# Altium schematic sheet 1 power.SchDoc
size A4; DocumentNumber: 1; SheetNumber: 3; SheetTotal: 9
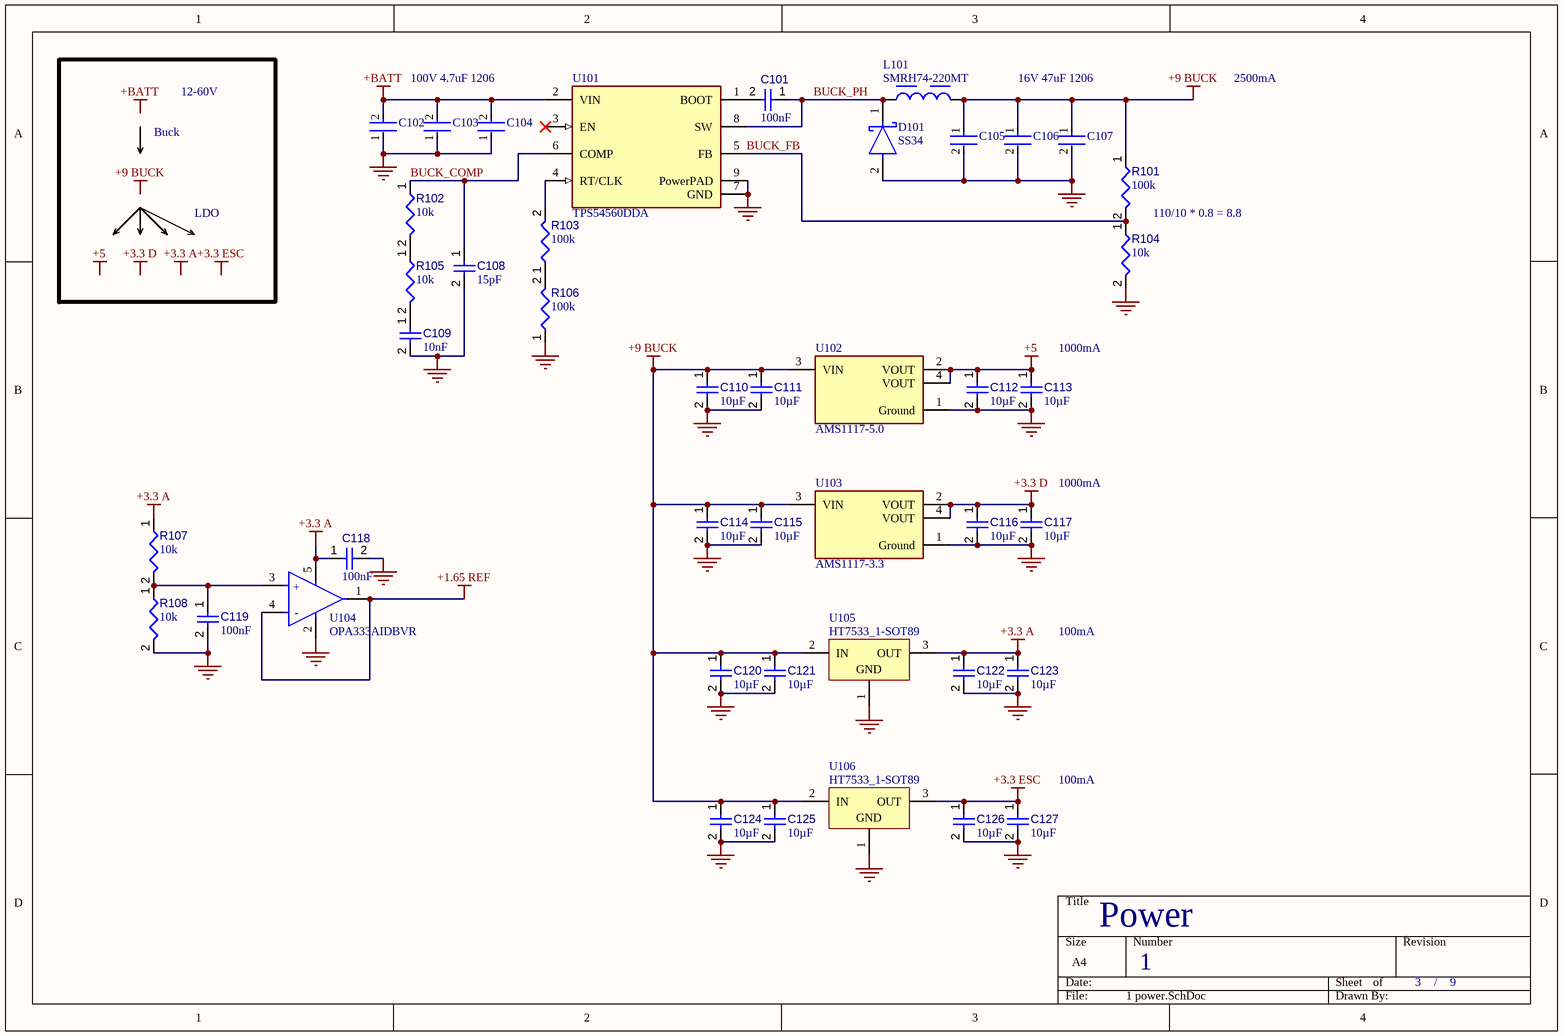
[diagram p0: 1 power.SchDoc]

## Parts
C101  value 100nF  [CAPC0402(1005)60_L]  (hidden comment: Capacitor 100nF +/-20% 25V 0402)
C102  GRM31CZ72A475KE11L  [FP-GRM31C-0_3-e0_3_0_9-MFG]  (value not drawn)
C103  GRM31CZ72A475KE11L  [FP-GRM31C-0_3-e0_3_0_9-MFG]  (value not drawn)
C104  GRM31CZ72A475KE11L  [FP-GRM31C-0_3-e0_3_0_9-MFG]  (value not drawn)
C105  C3216X5R1C476M160AB  [FP-C3216-160-0_2-MFG]  (value not drawn)
C106  C3216X5R1C476M160AB  [FP-C3216-160-0_2-MFG]  (value not drawn)
C107  C3216X5R1C476M160AB  [FP-C3216-160-0_2-MFG]  (value not drawn)
C108  value 15pF  [CAPC0402(1005)60_L]  (hidden comment: Capacitor 15pF +/-20% 50V 0402)
C109  value 10nF  [CAPC0402(1005)60_L]  (hidden comment: Capacitor 10nF +/-20% 50V 0402)
C110  value 10µF  [CAPC0603(1608)100_L]  (hidden comment: Capacitor 10µF +/-20% 10V 0603)
C111  value 10µF  [CAPC0603(1608)100_L]  (hidden comment: Capacitor 10µF +/-20% 10V 0603)
C112  value 10µF  [CAPC0603(1608)100_L]  (hidden comment: Capacitor 10µF +/-20% 10V 0603)
C113  value 10µF  [CAPC0603(1608)100_L]  (hidden comment: Capacitor 10µF +/-20% 10V 0603)
C114  value 10µF  [CAPC0603(1608)100_L]  (hidden comment: Capacitor 10µF +/-20% 10V 0603)
C115  value 10µF  [CAPC0603(1608)100_L]  (hidden comment: Capacitor 10µF +/-20% 10V 0603)
C116  value 10µF  [CAPC0603(1608)100_L]  (hidden comment: Capacitor 10µF +/-20% 10V 0603)
C117  value 10µF  [CAPC0603(1608)100_L]  (hidden comment: Capacitor 10µF +/-20% 10V 0603)
C118  value 100nF  [CAPC0402(1005)60_L]  (hidden comment: Capacitor 100nF +/-20% 25V 0402)
C119  value 100nF  [CAPC0402(1005)60_L]  (hidden comment: Capacitor 100nF +/-20% 25V 0402)
C120  value 10µF  [CAPC0603(1608)100_L]  (hidden comment: Capacitor 10µF +/-20% 10V 0603)
C121  value 10µF  [CAPC0603(1608)100_L]  (hidden comment: Capacitor 10µF +/-20% 10V 0603)
C122  value 10µF  [CAPC0603(1608)100_L]  (hidden comment: Capacitor 10µF +/-20% 10V 0603)
C123  value 10µF  [CAPC0603(1608)100_L]  (hidden comment: Capacitor 10µF +/-20% 10V 0603)
C124  value 10µF  [CAPC0603(1608)100_L]  (hidden comment: Capacitor 10µF +/-20% 10V 0603)
C125  value 10µF  [CAPC0603(1608)100_L]  (hidden comment: Capacitor 10µF +/-20% 10V 0603)
C126  value 10µF  [CAPC0603(1608)100_L]  (hidden comment: Capacitor 10µF +/-20% 10V 0603)
C127  value 10µF  [CAPC0603(1608)100_L]  (hidden comment: Capacitor 10µF +/-20% 10V 0603)
D101  SS34  [FP-SMA-MFG]
L101  SMRH74-220MT  [WE-HCI_7040]
R101  value 100k  [RESC0402(1005)_L]  (hidden comment: Resistor 100K +/-1 % 0402 63 mW)
R102  value 10k  [RESC0402(1005)_L]  (hidden comment: Resistor 10K  +/-1 % 0402 63 mW)
R103  value 100k  [RESC0402(1005)_L]  (hidden comment: Resistor 100K +/-1 % 0402 63 mW)
R104  value 10k  [RESC0402(1005)_L]  (hidden comment: Resistor 10K  +/-1 % 0402 63 mW)
R105  value 10k  [RESC0402(1005)_L]  (hidden comment: Resistor 10K  +/-1 % 0402 63 mW)
R106  value 100k  [RESC0402(1005)_L]  (hidden comment: Resistor 100K +/-1 % 0402 63 mW)
R107  value 10k  [RESC0402(1005)_L]  (hidden comment: Resistor 10K  +/-1 % 0402 63 mW)
R108  value 10k  [RESC0402(1005)_L]  (hidden comment: Resistor 10K  +/-1 % 0402 63 mW)
U101  TPS54560DDA  [FP-DDA0008E-IPC_C]
U102  AMS1117-5.0  [FP-AMS1117-IPC_C]
U103  AMS1117-3.3  [FP-AMS1117-IPC_C]
U104  OPA333AIDBVR  [FP-DBV0005A-MFG]
U105  HT7533_1-SOT89  [SOT89_L]
U106  HT7533_1-SOT89  [SOT89_L]

## Nets
+1.65 REF: U104.1(OUT) U104.4(-IN)
+3.3 A: C118.1 C122.1 C123.1 R107.1 U104.5(V+) U105.3(OUT)
+3.3 D: C116.1 C117.1 U103.2(VOUT) U103.4(VOUT)
+3.3 ESC: C126.1 C127.1 U106.3(OUT)
+5: C112.1 C113.1 U102.2(VOUT) U102.4(VOUT)
+9 BUCK: C105.1 C106.1 C107.1 C110.1 C111.1 C114.1 C115.1 C120.1 C121.1 C124.1 C125.1 L101.2 R101.1 U102.3(VIN) U103.3(VIN) U105.2(IN) U106.2(IN)
+BATT: C102.2 C103.2 C104.2 U101.2(VIN)
GND: C102.1 C103.1 C104.1 C105.2 C106.2 C107.2 C108.2 C109.2 C110.2 C111.2 C112.2 C113.2 C114.2 C115.2 C116.2 C117.2 C118.2 C119.2 C120.2 C121.2 C122.2 C123.2 C124.2 C125.2 C126.2 C127.2 D101.2(A) R104.2 R106.1 R108.2 U101.7(GND) U101.9(PowerPAD) U102.1(Ground) U103.1(Ground) U104.2(V-) U105.1(GND) U106.1(GND)
BUCK_COMP: C108.1 R102.1 U101.6(COMP)
BUCK_FB: R101.2 R104.1 U101.5(FB)
BUCK_PH: C101.1 D101.1(C) L101.1 U101.8(SW)
NetC101_2: C101.2 U101.1(BOOT)
NetC109_1: C109.1 R105.2
NetC119_1: C119.1 R107.2 R108.1 U104.3(+IN)
NetR102_2: R102.2 R105.1
NetR103_1: R103.1 R106.2
NetR103_2: R103.2 U101.4(RT/CLK)

Not connected (* = marked no-connect by the designer): U101 3(EN)*

## Notes on the sheet
- 12-60V
- 100V 4.7uF 1206
- 16V 47uF 1206
- 2500mA
- Buck
- LDO
- 110/10 * 0.8 = 8.8
- (near C113) 1000mA
- (near C117) 1000mA
- (near C123) 100mA
- (near C127) 100mA
- Power
- /
- Labels drawn without touching a wire or pin: +3.3 A, +3.3 D, +3.3 ESC, +5, +9 BUCK, +BATT
- (in symbol CMP-0272-00862-4) +; -

## Library data of the parts
C101 C118 C119 = CMP-001-00065-4: Chip Capacitor, 100nF +/-20%, 25V, 0402, Thickness 0.6 mm; Tolerance: 10%; Max Operating Temperature: 85°C; Min Operating Temperature: -55°C; Pins: 2; Voltage Rating: 25V; Mounting Technology: SMT; Case/Package: 0402
C102-C104 = CMP-06035-056253-1: Chip Multilayer Ceramic Capacitors for General Purpose, 1206, 4.7uF, X7R, 15%, 10%, 100V
C105-C107 = CMP-2000-07442-2: Multilayer Ceramic Capacitors 47uF ±20% 16V X5R SMD 1206; Resistor Type: Ceramic; Width: 0.063inch; Case Code (Imperial): 1206; Radiation Hardening: No; Thickness: 0.071inch; Dielectric: X5R; Weight: 0.000571oz; Termination: SMD/SMT; Dielectric Material: Ceramic; Min Operating Temperature: -55°C; Depth: 1.6mm; Case Code (Metric): 3216; Max Operating Temperature: 85°C; RoHS Compliant: Yes; REACH SVHC: No SVHC; Mount: Surface Mount; Lead Free: Lead Free; Height: 1.6mm; Length: 3.2mm; Tolerance: 20%; Voltage Rating (DC): 16V; Capacitance: 47uF; Package Quantity: 1; Construction: Flat; Packaging: Tape and Reel; Series: C; Case/Package: 1206; Voltage Rating: 16V
C108 = CMP-001-00069-3: Chip Capacitor, 15pF +/-20%, 50V, 0402, Thickness 0.6 mm; Tolerance: 5%; Max Operating Temperature: 85°C; Pins: 2; Case/Package: 0402; Voltage Rating: 50V; Min Operating Temperature: -55°C; Mounting Technology: SMT; JLCPCB Part #: C1548
C109 = CMP-001-00069-3: Chip Capacitor, 10nF +/-20%, 50V, 0402, Thickness 0.6 mm; Tolerance: 5%; Max Operating Temperature: 85°C; Pins: 2; Case/Package: 0402; Voltage Rating: 50V; Min Operating Temperature: -55°C; Mounting Technology: SMT; JLCPCB Part #: C15195
C110-C117 C120-C127 = CMP-001-00075-4: Chip Capacitor, 10µF +/-20%, 10V, 0603, Thickness 1 mm; Tolerance: 10%; Voltage Rating: 10V; Max Operating Temperature: 85°C; Pins: 2; Case/Package: 0603; Mounting Technology: SMT; Min Operating Temperature: -55°C
D101 = CMP-1667-00003-3: DIODE SCHOTTKY 40V 3A SMA; Max Forward Surge Current (Ifsm): 80A; Forward Voltage: 500mV; Polarity: Standard; Max Reverse Current: 500uA; Capacitance: 250pF; Element Configuration: Single; Mount: Surface Mount; Output Current: 3A; Radiation Hardening: No; Width: 2.92mm; Current Rating: 3A; Termination: SMD/SMT; Voltage: 40V; Series: -; Max Operating Temperature: 125°C; Current: 3A; Max Repetitive Reverse Voltage (Vrrm): 40V; Min Operating Temperature: -55°C; REACH SVHC: No SVHC; Number of Pins: 2; Average Rectified Current: 3A; Contact Plating: Tin; RoHS Compliant: Yes; Max Reverse Voltage (DC): 40V; Packaging: Tape and Reel; Height: 2.3mm; Length: 4.6mm; Case/Package: SMA; Weight: 0.002258oz; Peak Non-Repetitive Surge Current: 80A; Package Quantity: 5000; Lead Free: Lead Free; Forward Current: 3A; Voltage Rating (DC): 40V
L101 = CMP-0226-00071-2: NexarPartId: 7864301; Max DC Current: 6A; Series Resistance: 19.5Ω; Shielding: Shielded; DC Resistance (DCR): 19.5mΩ; Inductance: 4.7µH; Tolerance: 20%; Test Frequency: 100kHz; Self Resonant Frequency: 33MHz; Saturation Current: 7A; Height - Seated (Max): 3.9878mm; Height: 3.8mm; Packaging: Cut Tape (CT); REACH SVHC: Unknown; Width: 6.9mm; Mount: Surface Mount; Termination: SMD/SMT; Composition: Wirewound; Depth: 6.9mm; Ambient Temperature Range High: 100°C; Lead Free: Lead Free; Current Rating: 6A; Length: 7mm; RMS Current (Irms): 6A; Ambient Temperature Range Low: -40°C; Number of Pins: 2; Case/Package: Nonstandard; Min Operating Temperature: -40°C; RoHS: Compliant; Resistance: 19.5mΩ; Max Operating Temperature: 150°C; Inductance Tolerance: 20%
R101 R103 R106 = CMP-009-00168-3: Chip Resistor, 100 kOhms, +/-1 %, 63 mW, -55 to 155 degC, 0402; Tolerance: 1%; Power: 63mW; Max Operating Temperature: 155°C; Min Operating Temperature: -55°C; Pins: 2; Case/Package: 0402
R102 R104 R105 R107 R108 = CMP-009-00149-3: Chip Resistor, 10 kOhms, +/-1 %, 63 mW, -55 to 125 degC, 0402; Power: 63mW; Tolerance: 1%; Min Operating Temperature: -55°C; Case/Package: 0402; Max Operating Temperature: 155°C; Pins: 2
U101 = CMP-04918-000033-1: IC REG BCK SPLIT RAIL ADJ 8SOPWR; Manufacturer: Texas Instruments; Min Supply Voltage: 4.5V; Switching Topology: Buck; Max Junction Temp: +150°C; Max Duty Cycle: 100%; Standoff Height: 0mm; Output Type: AdjustableProgrammable; Output Voltage: 0.8-58.8V; Output Current: 5A; Number Of Outputs: 1; Switching Frequency: 100-2500kHz; Max Supply Voltage: 60V; Nominal Supply Current: 146uA; Octopart: https://octopart.com/tps54560dda-texas+instruments-26977150; Temperature: -40°C to +125°C; ComponentLink2Description: Datasheet; Category: IC; Mouser Description: Voltage Regulators - Switching Regulators 60V Input 5 A SD DC-DC Cnvtr; Automotive: No; Ipc Land Pattern Name: SOIC127P600X170-8; Height: 1.7mm; RoHS: TRUE; ComponentLink2URL: http://www.ti.com/lit/ds/symlink/tps54560.pdf; Device Class L3: Voltage Regulators - Switching; Temperature Range High: +125°C; Device Class L2: Power Management ICs; Package: DDA0008E; Lead Free: Yes; Digikey Description: IC REG BCK SPLIT RAIL ADJ 8SOPWR; Device Class L1: Integrated Circuits (ICs); Manufacturer Part Number: TPS54560DDA; Temperature Range Low: -40°C
U102 = CMP-209535-000001-1: LDO Voltage Regulators 1A, 5.0V; Manufacturer: Advanced Monolithic Systems; Dropout Voltage: 1.1V; Output Type: Fixed; Nominal Supply Current: 5mA; Output Voltage: 3.3V; Max Power Dissipation: 1.2W; Max Supply Voltage: 15V; Number Of Outputs: 1; Standoff Height: 0.64mm; Max Junction Temp: +125°C; Height: 1.8mm; Package: AMS1117; Device Class L2: Power Management ICs; ComponentLink2Description: Datasheet; ComponentLink2URL: http://www.advanced-monolithic.com/pdf/ds1117.pdf; Category: IC; RoHS: TRUE; Automotive: No; Device Class L1: Integrated Circuits (ICs); Output Current: 1A; Device Class L3: Voltage Regulators - Linear; Temperature: -40°C to +125°C; Manufacturer Part Number: AMS1117-5.0; Temperature Range Low: -40°C; Lead Free: Yes; Ipc Land Pattern Name: SOT229P700X180-4; Temperature Range High: +125°C; JLCPCB Part #: C6187
U103 = CMP-209535-000001-1: LDO Voltage Regulators 1A, 3.3V; Manufacturer: Advanced Monolithic Systems; Dropout Voltage: 1.1V; Output Type: Fixed; Nominal Supply Current: 5mA; Max Power Dissipation: 1.2W; Max Supply Voltage: 15V; Number Of Outputs: 1; Standoff Height: 0.64mm; Max Junction Temp: +125°C; Height: 1.8mm; Package: AMS1117; Device Class L2: Power Management ICs; ComponentLink2Description: Datasheet; ComponentLink2URL: http://www.advanced-monolithic.com/pdf/ds1117.pdf; Category: IC; RoHS: TRUE; Automotive: No; Device Class L1: Integrated Circuits (ICs); Output Current: 1A; Device Class L3: Voltage Regulators - Linear; Temperature: -40°C to +125°C; Output Voltage: 3.3V; Manufacturer Part Number: AMS1117-3.3; Temperature Range Low: -40°C; Octopart: https://octopart.com/ams1117-3.3-advanced+monolithic+systems-25899300; Lead Free: Yes; Ipc Land Pattern Name: SOT229P700X180-4; Temperature Range High: +125°C; JLCPCB Part #: C6186
U104 = CMP-0272-00862-4: IC OPAMP ZER-DRIFT 1CIRC SOT23-5; Number of Elements: 1; Common Mode Rejection Ratio: 106dB; Max Supply Voltage: 5.5V; Min Supply Voltage: 1.8V; Max I/O Voltage: 10uV; Output Current per Channel: 5mA; Max Dual Supply Voltage: 2.75V; Operating Supply Current: 17uA; Nominal Supply Current: 25uA; Bandwidth: 350kHz; Min Dual Supply Voltage: 900mV; Power Supply Rejection Ratio (PSRR): 120dB; Voltage Gain: 130dB; Input Bias Current: 200pA; Slew Rate: 0.16V/µs; Number of Channels: 1; Max Operating Temperature: 125°C; REACH SVHC: No SVHC; Number of Amplifiers: 1; Input Offset Voltage (Vos): 10uV; Radiation Hardening: No; Lead Free: Lead Free; Operating Supply Voltage: 2.75V; Min Operating Temperature: -40°C; Contact Plating: Gold; Number of Pins: 5; Output Current: 5mA; Packaging: Tape and Reel; Unity Gain Bandwidth Product: 350kHz; Number of Circuits: 1; Gain Bandwidth Product: 350kHz; Case/Package: SOT-23-5; Package Quantity: 1
U105 U106 = CMP-0204-00101-1: 100mA Low Power LDO, Output Voltage 3.3V, SOT89 Pkg; DatasheetVersion: Rev1.80, Mar-2010; PackageDescription: 3-Pin SOT-89 Package 1.5 mm Pitch, 4.1 mm Lead Span; PackageReference: SOT89; PackageVersion: May-2010; Code_IPC: SOT89